# EAGLE design MIC_Breakout (EAGLE 7.2.0)
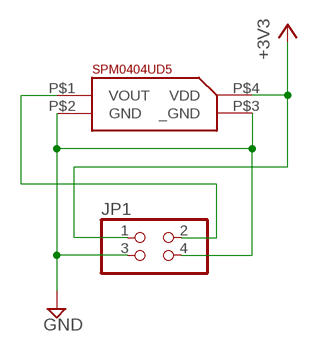
[diagram p0: schematic, sheet 1]

## Parts
JP1  PINHD-2X2  [2X02]
SPM0404UD5  SPM0404UD5  [KNOWLES_SPM]

## Nets
+3V3: JP1.1 SPM0404UD5.P$4(VDD)
GND: JP1.3 JP1.4 SPM0404UD5.P$2(GND) SPM0404UD5.P$3(_GND)
N$2: JP1.2 SPM0404UD5.P$1(VOUT)

## Library data of the parts
JP1 = Ian_Header:PINHD-2X2: PIN HEADER
SPM0404UD5 = Ian:SPM0404UD5

## Board
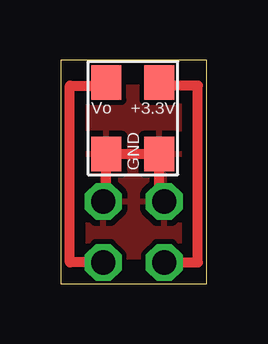
[diagram p1: board, top side]
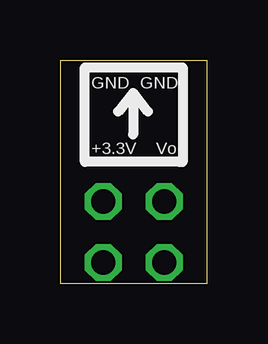
[diagram p2: board, bottom side, seen from below]

Size 6.08 x 9.32 mm. Coordinates in mm from the lower left corner, seen from the top.
Outline: 0,0 6.08,0 6.08,9.32 0,9.32 0,0
Copper layers (1*16): Top 0.035mm / dielectric 1.5mm / Bottom 0.035mm
Design rules "default": minimum track width 10mil, minimum drill 24mil, track to track 8mil, track to pad 8mil, pad to pad 8mil, via to via 8mil, smd to smd 8mil, copper to edge 40mil, drill to drill 8mil, minimum pad ring 10mil, minimum via ring 8mil, stop-mask expansion 4mil, vias tented up to drill 0mil, thermal gap 10mil

### Footprints (pad centres in the part's own frame; a part is rotated, then mirrored left to right if it is on the bottom)
2X02 = drill 1.016 octagon: 1 -1.27,-1.27; 2 -1.27,1.27; 3 1.27,-1.27; 4 1.27,1.27
KNOWLES_SPM = smd 1.245 x 1.448: P$1 -1.016,1.27; P$2 -1.016,-1.702; P$3 1.194,-1.702; P$4 1.194,1.27

### Placement (x,y rotation side)
JP1  3.05,2.16 90 top
SPM0404UD5  2.92,7.11 0 top

### Tracks (layer width: path | path; a pad name or v marks a point on that pad's centre or on a via)
+3V3
  Top 0.406: JP1.1 5.71,0.89 5.71,8.26 4.12,8.26 SPM0404UD5.P$4
GND
  Top 0.406: JP1.4 1.91,3.43 SPM0404UD5.P$2 SPM0404UD5.P$3 4.12,3.43 JP1.3
  pour Top: 0,0 0,9.4 6.1,9.4 6.1,0
N$2
  Top 0.406: JP1.2 0.38,0.89 0.38,8.26 1.91,8.26 SPM0404UD5.P$1

### Text on the board
bPlace: GND | GND | Vo | +3.3V